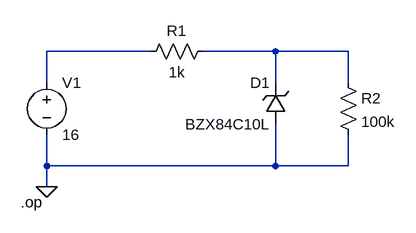
[diagram p0: schematic Assignment 3.4 Zener Diode.asc]
Assignment 3.4 Zener Diode.asc, the LTspice schematic file:
Version 4.1
SHEET 1 880 680
WIRE 208 64 48 64
WIRE 400 64 288 64
WIRE 512 64 400 64
WIRE 48 112 48 64
WIRE 400 112 400 64
WIRE 512 112 512 64
WIRE 48 240 48 192
WIRE 400 240 400 176
WIRE 400 240 48 240
WIRE 512 240 512 192
WIRE 512 240 400 240
WIRE 48 272 48 240
FLAG 48 272 0
SYMBOL voltage 48 96 R0
SYMATTR InstName V1
SYMATTR Value 16
SYMBOL res 304 48 R90
WINDOW 0 0 56 VBottom 2
WINDOW 3 32 56 VTop 2
SYMATTR InstName R1
SYMATTR Value 1k
SYMBOL res 496 96 R0
SYMATTR InstName R2
SYMATTR Value 100k
SYMBOL zener 416 176 R180
WINDOW 0 24 64 Left 2
WINDOW 3 24 0 Left 2
SYMATTR InstName D1
SYMATTR Value BZX84C10L
TEXT 8 296 Left 2 !.op

The netlist it stands for:
* Assignment 3.4 Zener Diode.asc
V1 N001 0 16
R1 N002 N001 1k
R2 N002 0 100k
D1 0 N002 BZX84C10L
.model D D
.lib standard.dio
.op
.backanno
.end